# Altium project RK_MEGAPLATA.PrjPcb (part 7 of 9)

## Sheet SD_CARD_SDIO.SchDoc
size 209 x 297 mm; SheetNumber: 19; SheetTotal: 23
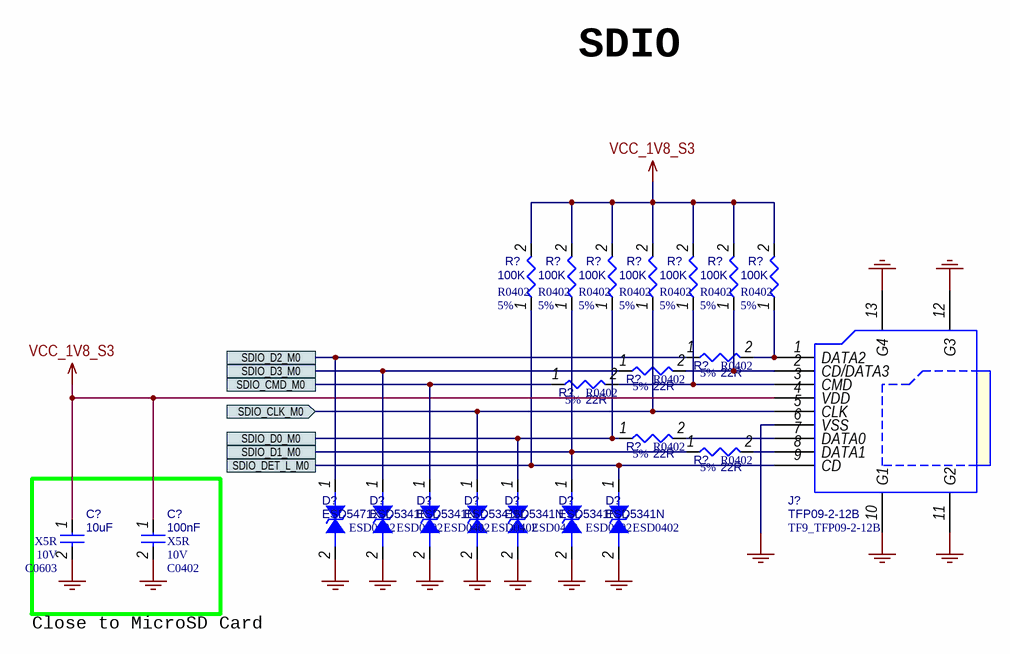
[diagram p21: SD_CARD_SDIO.SchDoc]

### Parts
(Parts that share a designator on the sheet are numbered #1, #2 ... from top to bottom, then left to right.)
C?#301  10uF  Dielectric: X5R  Voltage: 10V  [C0603]
C?#302  100nF  Dielectric: X5R  Voltage: 10V  [C0402]
D?#10  ESD5471X  [ESD0402]
D?#11  ESD5341N  [ESD0402]
D?#12  ESD5341N  [ESD0402]
D?#13  ESD5341N  [ESD0402]
D?#14  ESD5341N  [ESD0402]
D?#15  ESD5341N  [ESD0402]
D?#16  ESD5341N  [ESD0402]
J?#5  TFP09-2-12B  PCB Footprint: TF9_TFP09-2-12B  [TF-CKT01-009D]
R?#126  100K  Tolerance: 5%  [R0402]
R?#127  100K  Tolerance: 5%  [R0402]
R?#128  100K  Tolerance: 5%  [R0402]
R?#129  100K  Tolerance: 5%  [R0402]
R?#130  100K  Tolerance: 5%  [R0402]
R?#131  100K  Tolerance: 5%  [R0402]
R?#132  100K  Tolerance: 5%  [R0402]
R?#133  22R  Tolerance: 5%  [R0402]
R?#134  22R  Tolerance: 5%  [R0402]
R?#135  22R  Tolerance: 5%  [R0402]
R?#136  22R  Tolerance: 5%  [R0402]
R?#137  22R  Tolerance: 5%  [R0402]

### Ports
SDIO_CLK_M0 (in, see RK3588_BOOTLOADER_MAYBE_SDIO[2C]), SDIO_CMD_M0 (see RK3588_BOOTLOADER_MAYBE_SDIO[2C]), SDIO_D0_M0 (see RK3588_BOOTLOADER_MAYBE_SDIO[2C]), SDIO_D1_M0 (see RK3588_BOOTLOADER_MAYBE_SDIO[2C]), SDIO_D2_M0 (see RK3588_BOOTLOADER_MAYBE_SDIO[2C]), SDIO_D3_M0 (see RK3588_BOOTLOADER_MAYBE_SDIO[2C]), SDIO_DET_L_M0 (see RK3588_BOOTLOADER_MAYBE_SDIO[2C])

### Nets
GND: C?#301.2 C?#302.2 D?#10.2 D?#11.2 D?#12.2 D?#13.2 D?#14.2 D?#15.2 D?#16.2 J?#5.6(VSS) J?#5.10(G1) J?#5.11(G2) J?#5.12(G3) J?#5.13(G4)
VCC_1V8_S3: C?#301.1 C?#302.1 J?#5.4(VDD) R?#126.2 R?#127.2 R?#128.2 R?#129.2 R?#130.2 R?#131.2 R?#132.2
NetD?#10_1: D?#10.1 R?#133.1 ; port SDIO_D2_M0
NetD?#11_1: D?#11.1 R?#134.1 ; port SDIO_D3_M0
NetD?#12_1: D?#12.1 R?#135.1 ; port SDIO_CMD_M0
NetD?#13_1: D?#13.1 J?#5.5(CLK) R?#129.1 ; port SDIO_CLK_M0
NetD?#14_1: D?#14.1 R?#128.1 R?#136.1 ; port SDIO_D0_M0
NetD?#15_1: D?#15.1 R?#127.1 R?#137.1 ; port SDIO_D1_M0
NetD?#16_1: D?#16.1 J?#5.9(CD) R?#126.1 ; port SDIO_DET_L_M0
NetJ?#5_1: J?#5.1(DATA2) R?#132.1 R?#133.2
NetJ?#5_2: J?#5.2(CD/DATA3) R?#131.1 R?#134.2
NetJ?#5_3: J?#5.3(CMD) R?#130.1 R?#135.2
NetJ?#5_7: J?#5.7(DATA0) R?#136.2
NetJ?#5_8: J?#5.8(DATA1) R?#137.2

### Notes on the sheet
- SDIO
- Close to MicroSD Card
- 297x210
- Формат А4

### Library data of the parts
C?#301 = CAP NP_Dup1: cap,10.00uF,+/-10%,10V,X5R,C0603; Part Reference: C4201; Manufacturer PN: C1608X5R1A106K080AC; Manufacturer: TDK; Tolerance: 10%; C_Voltage: 6.3V; Priority: A; PCB Footprint: C0603; Value: 10uF; Created by: JJJ; Part Type: C0603; RK PN: C1608X5R1A106K080AC
C?#302 = CAP NP_Dup1: cap,100.00nF,+/-10%,10V,X5R,C0402; Part Reference: C4202; Manufacturer PN: C1005X5R1A104K050BA; Manufacturer: TDK; C_Voltage: 6.3V; Tolerance: 10%; Priority: A; Number: 37; PCB Footprint: C0402; Value: 100nF; Created by: JJJ; Part Type: C0402; RK PN: C1005X5R1A104K050BA
D?#10 = DIODE BI_DIR TRIG: 1-Line, Bi-directional, Transient Voltage Suppressors.9pF.; Part Reference: D4201; Manufacturer: WillSemi(О¤¶ы°лµјМе); Priority: A; PCB Footprint: ESD0402; Value: ESD5471X; Created by: JJJ; Manufacturer PN: ESD5471X; Part Type: ESD_TVS; RK PN: ESD5471X
D?#11 = DIODE BI_DIR TRIG: 1-Line, Bi-directional, Transient Voltage Suppressors.1pF.; Part Reference: D4202; Manufacturer: WillSemi(О¤¶ы°лµјМе); Priority: A; PCB Footprint: ESD0402; Value: ESD5341N; Created by: JJJ; Manufacturer PN: ESD5341N; Part Type: ESD_TVS; RK PN: ESD5341N
D?#12 = DIODE BI_DIR TRIG: 1-Line, Bi-directional, Transient Voltage Suppressors.1pF.; Part Reference: D4203; Manufacturer: WillSemi(О¤¶ы°лµјМе); Priority: A; PCB Footprint: ESD0402; Value: ESD5341N; Created by: JJJ; Manufacturer PN: ESD5341N; Part Type: ESD_TVS; RK PN: ESD5341N
D?#13 = DIODE BI_DIR TRIG: 1-Line, Bi-directional, Transient Voltage Suppressors.1pF.; Part Reference: D4204; Manufacturer: WillSemi(О¤¶ы°лµјМе); Priority: A; PCB Footprint: ESD0402; Value: ESD5341N; RK PN: ESD5341N; Part Type: ESD_TVS; Manufacturer PN: ESD5341N; Created by: JJJ
D?#14 = DIODE BI_DIR TRIG: 1-Line, Bi-directional, Transient Voltage Suppressors.1pF.; Part Reference: D4205; Manufacturer: WillSemi(О¤¶ы°лµјМе); Priority: A; PCB Footprint: ESD0402; Value: ESD5341N; RK PN: ESD5341N; Part Type: ESD_TVS; Manufacturer PN: ESD5341N; Created by: JJJ
D?#15 = DIODE BI_DIR TRIG: 1-Line, Bi-directional, Transient Voltage Suppressors.1pF.; Part Reference: D4206; Manufacturer: WillSemi(О¤¶ы°лµјМе); Priority: A; PCB Footprint: ESD0402; Value: ESD5341N; RK PN: ESD5341N; Part Type: ESD_TVS; Manufacturer PN: ESD5341N; Created by: JJJ
D?#16 = DIODE BI_DIR TRIG: 1-Line, Bi-directional, Transient Voltage Suppressors.1pF.; Part Reference: D4207; Manufacturer: WillSemi(О¤¶ы°лµјМе); Priority: A; PCB Footprint: ESD0402; Value: ESD5341N; RK PN: ESD5341N; Part Type: ESD_TVS; Manufacturer PN: ESD5341N; Created by: JJJ
J?#5 = TFCARD_SOCKET: НЁУГTFїЁЧщЈ¬И«іЯґз; Part Reference: J4200; Manufacturer: НъїЖґп; Priority: A; Value: TFP09-2-12B; Created by: JJJ; Manufacturer Part Number: TFP09-2-12B; Part Type: CARD Jack; RK PN: TFP09-2-12B
R?#126-R?#132 = RESISTOR_Dup2: НЁУГєсД¤µзЧи,100K,+/-5%,R0402,1/16W.; Part Reference: R4203; Manufacturer: YAGEO; RK PN: RC0402JR-07100KL; Priority: A; Wattage: 1/16W; PCB Footprint: R0402; Value: 100K; Part Type: НЁУГєсД¤µзЧи; Manufacturer PN: RC0402JR-07100KL; Created by: YTL
R?#133-R?#137 = RESISTOR_Dup2: НЁУГєсД¤µзЧи,22R,+/-5%,R0402,1/16W.; Part Reference: R1320; Manufacturer PN: RC0402JR-0722RL; Manufacturer: YAGEO; Wattage: 1/16W; Priority: A; PCB Footprint: R0402; Value: 22R; Created by: YTL; Part Type: НЁУГєсД¤µзЧи; RK PN: RC0402JR-0722RL

## Sheet HDMI2_0_RX.SchDoc
size 420 x 297 mm; SheetNumber: 20; SheetTotal: 23
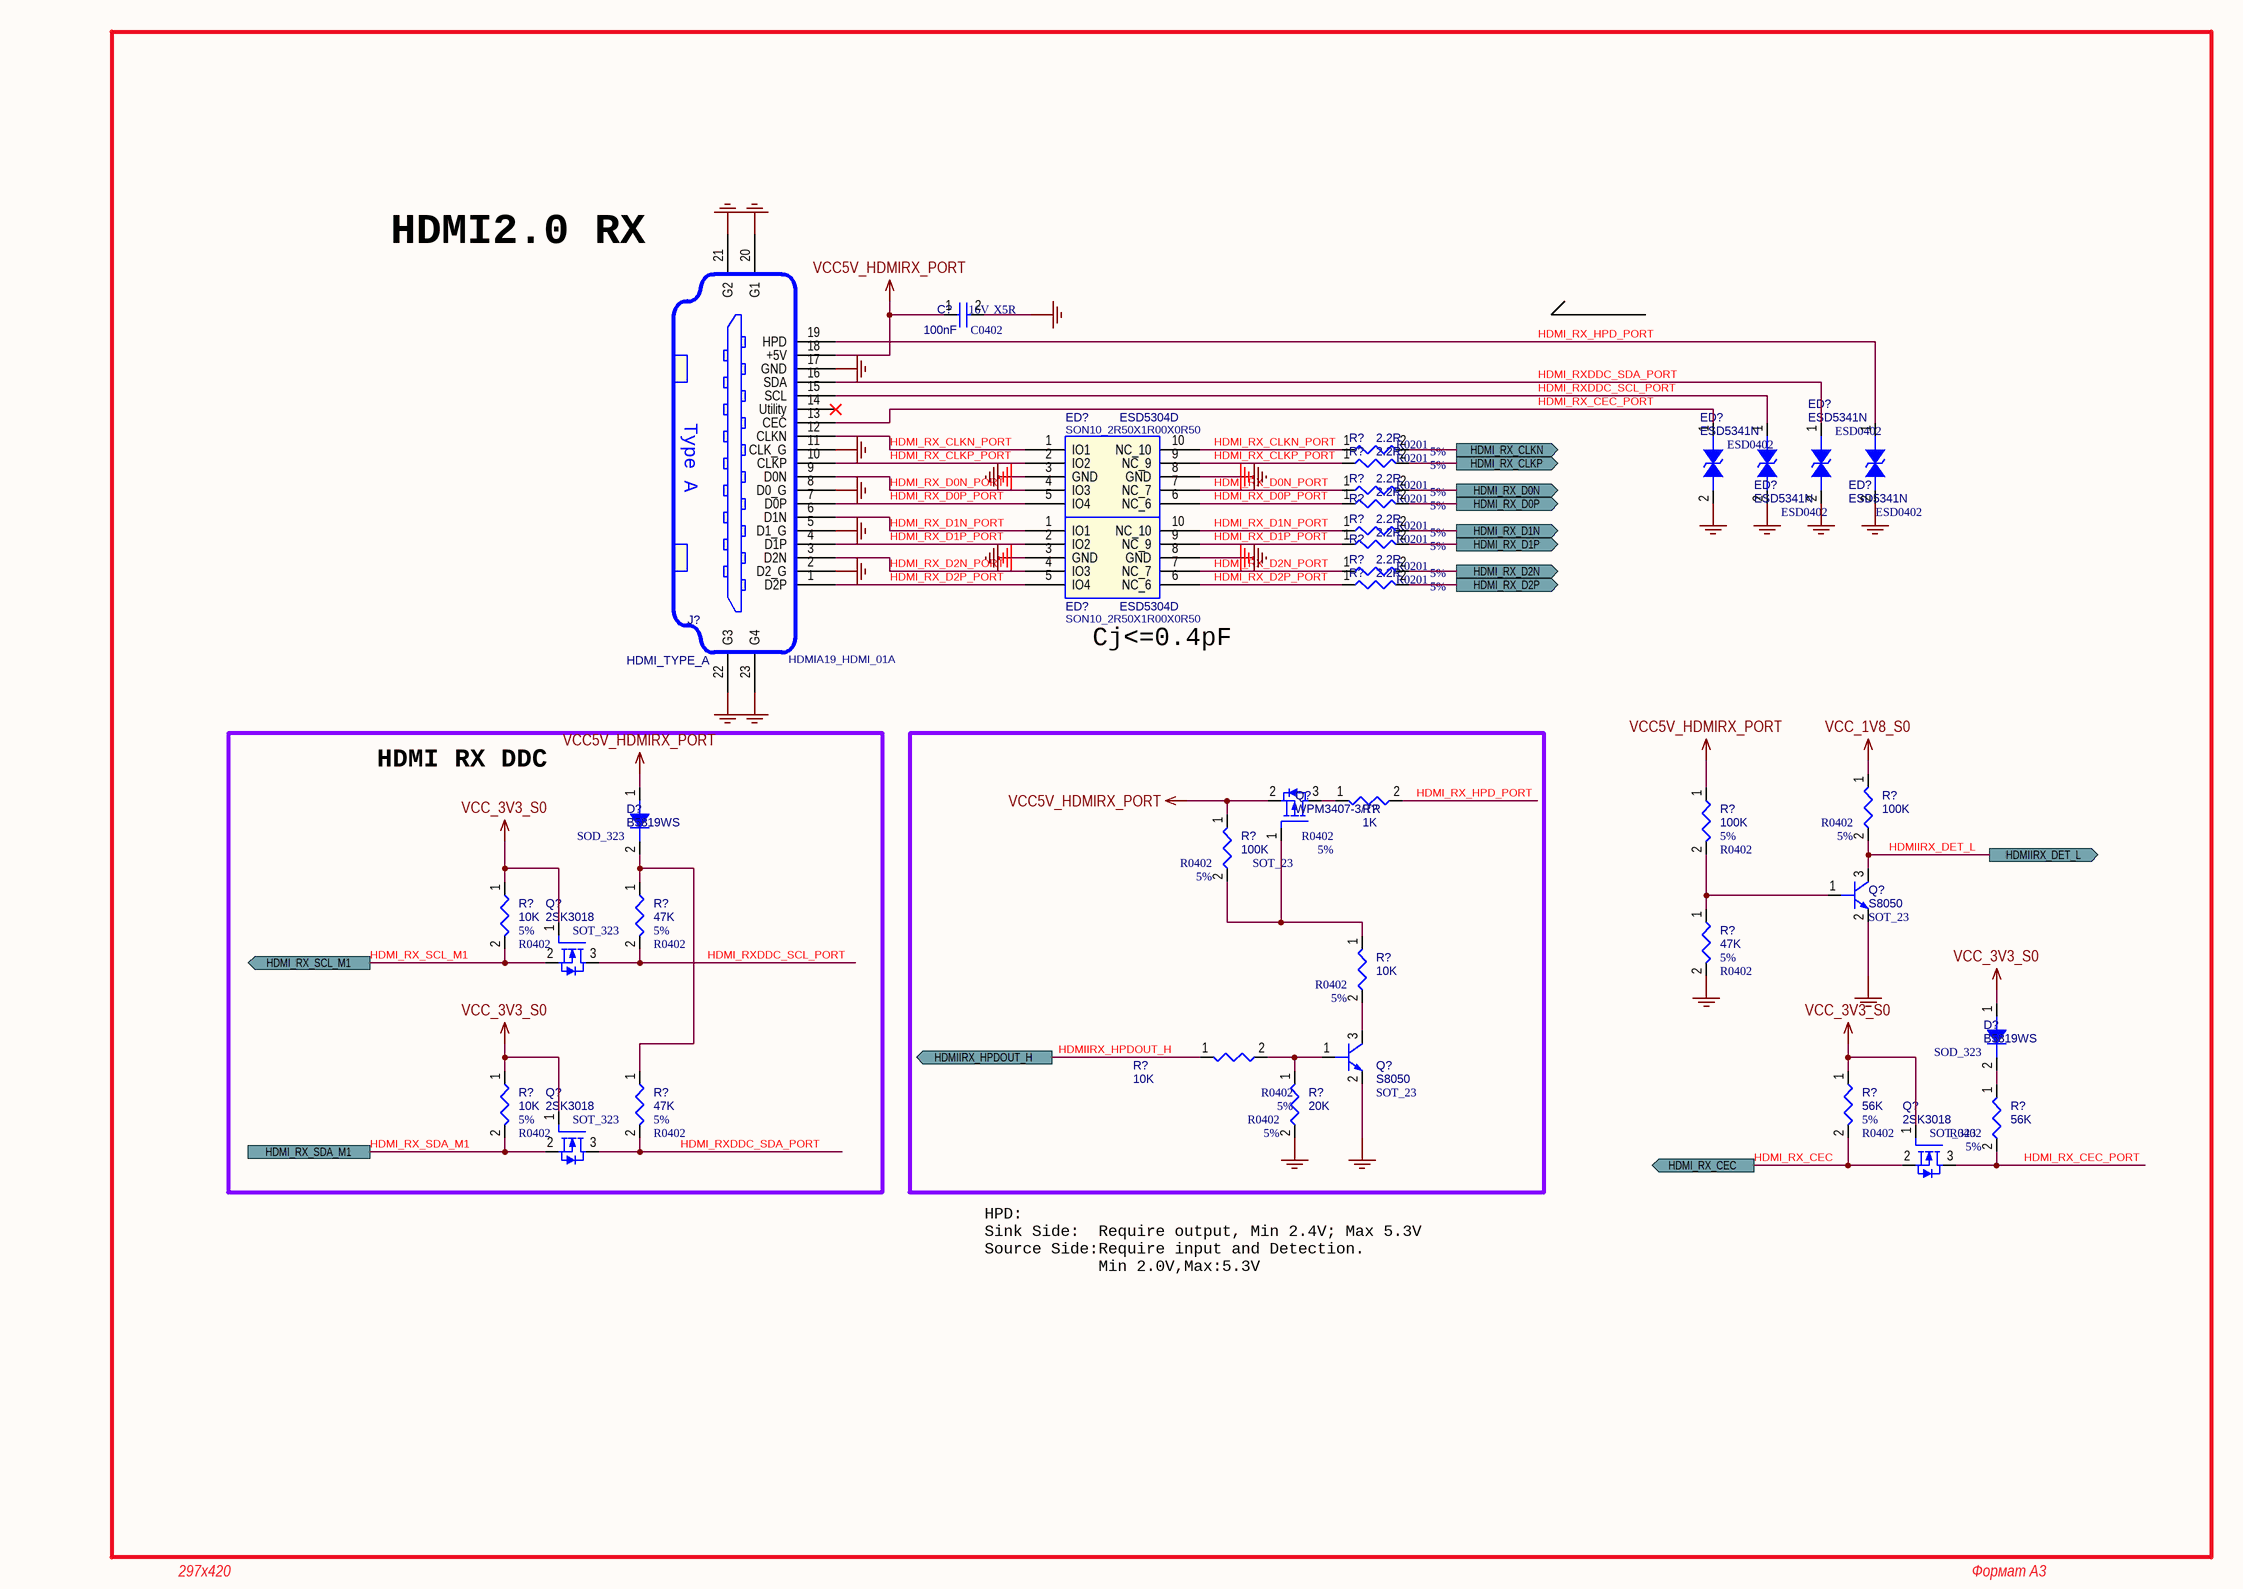
[diagram p22: HDMI2_0_RX.SchDoc]

### Parts
(Parts that share a designator on the sheet are numbered #1, #2 ... from top to bottom, then left to right.)
C?#303  100nF  Dielectric: X5R  Voltage: 16V  [C0402]
D?#17  B5819WS  [SOD_323]
D?#18  B5819WS  [SOD_323]
ED?#7  ESD5304D  [SON10_2R50X1R00X0R50]
ED?#8  ESD5341N  [ESD0402]
ED?#9  ESD5341N  [ESD0402]
ED?#10  ESD5341N  [ESD0402]
ED?#11  ESD5341N  [ESD0402]
ED?#12  ESD5304D  [SON10_2R50X1R00X0R50]
J?#6  HDMI_TYPE_A  [HDMIA19_HDMI_01A]
Q?#2  WPM3407-3/TR  PCB Footprint: SOT_23  [SOT23]
Q?#3  S8050  [SOT_23]
Q?#4  2SK3018  PCB Footprint: SOT_323  [SOT23]
Q?#5  S8050  [SOT_23]
Q?#6  2SK3018  PCB Footprint: SOT_323  [SOT23]
Q?#7  2SK3018  PCB Footprint: SOT_323  [SOT23]
R?#138  2.2R  Tolerance: 5%  PCB Footprint: R0201  [R0402]
R?#139  2.2R  Tolerance: 5%  PCB Footprint: R0201  [R0402]
R?#140  2.2R  Tolerance: 5%  PCB Footprint: R0201  [R0402]
R?#141  2.2R  Tolerance: 5%  PCB Footprint: R0201  [R0402]
R?#142  2.2R  Tolerance: 5%  PCB Footprint: R0201  [R0402]
R?#143  2.2R  Tolerance: 5%  PCB Footprint: R0201  [R0402]
R?#144  2.2R  Tolerance: 5%  PCB Footprint: R0201  [R0402]
R?#145  2.2R  Tolerance: 5%  PCB Footprint: R0201  [R0402]
R?#146  1K  Tolerance: 5%  [R0402]
R?#147  100K  Tolerance: 5%  [R0402]
R?#148  100K  Tolerance: 5%  [R0402]
R?#149  100K  Tolerance: 5%  [R0402]
R?#150  10K  Tolerance: 5%  [R0402]
R?#151  47K  Tolerance: 5%  [R0402]
R?#152  47K  Tolerance: 5%  [R0402]
R?#153  10K  Tolerance: 5%  [R0402]
R?#154  10K  Tolerance: 5%  [R0402]
R?#155  10K  Tolerance: 5%  [R0402]
R?#156  47K  Tolerance: 5%  [R0402]
R?#157  20K  Tolerance: 5%  [R0402]
R?#158  56K  Tolerance: 5%  [R0402]
R?#159  56K  Tolerance: 5%  [R0402]

### Blocks framed on the sheet
HDMI RX DDC: D?#17 Q?#4 Q?#6 R?#150 R?#151 R?#155 R?#156

### Ports
HDMI_RX_CEC (out, see RK3588_GPIO_MAYBE_IMPORTANT_PINS[2B]), HDMI_RX_CLKN (out, see RK3588_HDMI[3B]), HDMI_RX_CLKP (out, see RK3588_HDMI[3B]), HDMI_RX_D0N (out, see RK3588_HDMI[3A]), HDMI_RX_D0P (out, see RK3588_HDMI[3A]), HDMI_RX_D1N (out, see RK3588_HDMI[3A]), HDMI_RX_D1P (out, see RK3588_HDMI[3A]), HDMI_RX_D2N (out, see RK3588_HDMI[3B]), HDMI_RX_D2P (out, see RK3588_HDMI[3A]), HDMI_RX_SCL_M1 (out, see RK3588_GPIO_MAYBE_IMPORTANT_PINS[2B]), HDMI_RX_SDA_M1 (see RK3588_GPIO_MAYBE_IMPORTANT_PINS[2B]), HDMIIRX_DET_L (out, see RK3588_BOOTLOADER_MAYBE_SDIO[2B]), HDMIIRX_HPDOUT_H (out, see RK3588_GPIO_MAYBE_IMPORTANT_PINS[2B])

### Nets
GND: C?#303.2 ED?#7.3(GND) ED?#7.8(GND) ED?#8.2 ED?#9.2 ED?#10.2 ED?#11.2 ED?#12.3(GND) ED?#12.8(GND) J?#6.2(D2_G) J?#6.5(D1_G) J?#6.8(D0_G) J?#6.11(CLK_G) J?#6.17(GND) J?#6.20(G1) J?#6.21(G2) J?#6.22(G3) J?#6.23(G4) Q?#3.2(EMITTER) Q?#5.2(EMITTER) R?#152.2 R?#157.2
VCC5V_HDMIRX_PORT: C?#303.1 D?#17.1(A) J?#6.18(+5V) Q?#2.2(SOURCE) R?#148.1 R?#149.1
VCC_1V8_S0: R?#147.1
VCC_3V3_S0: D?#18.1(A) Q?#4.1(GATE) Q?#6.1(GATE) Q?#7.1(GATE) R?#150.1 R?#155.1 R?#158.1
HDMI_RX_CEC: Q?#7.2(SOURCE) R?#158.2 ; port HDMI_RX_CEC
HDMI_RX_CEC_PORT: ED?#8.1 J?#6.13(CEC) Q?#7.3(DRAIN) R?#159.2
HDMI_RX_CLKN_PORT: ED?#7.1(IO1) ED?#7.10(NC_10) J?#6.12(CLKN) R?#138.1
HDMI_RX_CLKP_PORT: ED?#7.2(IO2) ED?#7.9(NC_9) J?#6.10(CLKP) R?#139.1
HDMI_RX_D0N_PORT: ED?#7.4(IO3) ED?#7.7(NC_7) J?#6.9(D0N) R?#140.1
HDMI_RX_D0P_PORT: ED?#7.5(IO4) ED?#7.6(NC_6) J?#6.7(D0P) R?#141.1
HDMI_RX_D1N_PORT: ED?#12.1(IO1) ED?#12.10(NC_10) J?#6.6(D1N) R?#142.1
HDMI_RX_D1P_PORT: ED?#12.2(IO2) ED?#12.9(NC_9) J?#6.4(D1P) R?#143.1
HDMI_RX_D2N_PORT: ED?#12.4(IO3) ED?#12.7(NC_7) J?#6.3(D2N) R?#144.1
HDMI_RX_D2P_PORT: ED?#12.5(IO4) ED?#12.6(NC_6) J?#6.1(D2P) R?#145.1
HDMI_RX_HPD_PORT: ED?#11.1 J?#6.19(HPD) R?#146.2
HDMI_RX_SCL_M1: Q?#4.2(SOURCE) R?#150.2 ; port HDMI_RX_SCL_M1
HDMI_RX_SDA_M1: Q?#6.2(SOURCE) R?#155.2 ; port HDMI_RX_SDA_M1
HDMI_RXDDC_SCL_PORT: ED?#9.1 J?#6.15(SCL) Q?#4.3(DRAIN) R?#151.2
HDMI_RXDDC_SDA_PORT: ED?#10.1 J?#6.16(SDA) Q?#6.3(DRAIN) R?#156.2
HDMIIRX_DET_L: Q?#3.3(COLLECTOR) R?#147.2 ; port HDMIIRX_DET_L
HDMIIRX_HPDOUT_H: R?#154.1 ; port HDMIIRX_HPDOUT_H
NetD?#17_2: D?#17.2(K) R?#151.1 R?#156.1
NetD?#18_2: D?#18.2(K) R?#159.1
NetQ?#2_1: Q?#2.1(GATE) R?#149.2 R?#153.1
NetQ?#2_3: Q?#2.3(DRAIN) R?#146.1
NetQ?#3_1: Q?#3.1(BASE) R?#148.2 R?#152.1
NetQ?#5_1: Q?#5.1(BASE) R?#154.2 R?#157.1
NetQ?#5_3: Q?#5.3(COLLECTOR) R?#153.2
NetR?#138_2: R?#138.2 ; port HDMI_RX_CLKN
NetR?#139_2: R?#139.2 ; port HDMI_RX_CLKP
NetR?#140_2: R?#140.2 ; port HDMI_RX_D0N
NetR?#141_2: R?#141.2 ; port HDMI_RX_D0P
NetR?#142_2: R?#142.2 ; port HDMI_RX_D1N
NetR?#143_2: R?#143.2 ; port HDMI_RX_D1P
NetR?#144_2: R?#144.2 ; port HDMI_RX_D2N
NetR?#145_2: R?#145.2 ; port HDMI_RX_D2P

Not connected (* = marked no-connect by the designer): J?#6 14(Utility)*

### Notes on the sheet
- HDMI2.0 RX
- (near ED?#12) Cj<=0.4pF
- HPD:
  Sink Side:  Require output, Min 2.4V; Max 5.3V
  Source Side:Require input and Detection.
  Min 2.0V,Max:5.3V
- 297x420
- Формат А3
- (in symbol HDMI_TYPE_A_0) Type A

### Library data of the parts
C?#303 = CAP NP_Dup1: cap,100.00nF,+/-10%,16V,X5R,C0402; Part Reference: C4900; Manufacturer PN: C1005X5R1C104K050BA; Manufacturer: TDK; C_Voltage: 10V; Tolerance: 10%; Priority: A; Number: 37; PCB Footprint: C0402; Value: 100nF; Created by: JJJ; Part Type: C0402; RK PN: C1005X5R1C104K050BA
D?#17 = DIODE: Schottky BarrierЈ¬B5819WS SOD-323; Part Reference: D4900; Manufacturer: і¤µз; Priority: A; PCB Footprint: SOD_323; Value: B5819WS; Created by: JJJ; Manufacturer PN: B5819WS; Part Type: Schottky rectifier; RK PN: B5819WS
D?#18 = DIODE: Schottky BarrierЈ¬B5819WS SOD-323; Part Reference: D4901; Manufacturer: і¤µз; Priority: A; PCB Footprint: SOD_323; Value: B5819WS; RK PN: B5819WS; Part Type: Schottky rectifier; Manufacturer PN: B5819WS; Created by: JJJ
ED?#7 = ESD_ESD5304D: 4-Lines, Uni-directional, Ultra-low Capacitance Transient Voltage Suppressors; Part Reference: ED4900; Manufacturer: WillSemi(О¤¶ы°лµјМе); Priority: A; PCB Footprint: SON10_2R50X1R00X0R50; Value: ESD5304D; Created by: JJJ; Manufacturer PN: ESD5304D; Part Type: ESD_TVS; RK PN: ESD5304D
ED?#8 = DIODE BI_DIR TRIG: 1-Line, Bi-directional, Transient Voltage Suppressors.1pF.; Part Reference: ED4901; Manufacturer: WillSemi(О¤¶ы°лµјМе); Priority: A; PCB Footprint: ESD0402; Value: ESD5341N; Created by: JJJ; Manufacturer PN: ESD5341N; Part Type: ESD_TVS; RK PN: ESD5341N
ED?#9 = DIODE BI_DIR TRIG: 1-Line, Bi-directional, Transient Voltage Suppressors.1pF.; Part Reference: ED4902; Manufacturer: WillSemi(О¤¶ы°лµјМе); Priority: A; PCB Footprint: ESD0402; Value: ESD5341N; Created by: JJJ; Manufacturer PN: ESD5341N; Part Type: ESD_TVS; RK PN: ESD5341N
ED?#10 = DIODE BI_DIR TRIG: 1-Line, Bi-directional, Transient Voltage Suppressors.1pF.; Part Reference: ED4903; Manufacturer: WillSemi(О¤¶ы°лµјМе); Priority: A; PCB Footprint: ESD0402; Value: ESD5341N; RK PN: ESD5341N; Part Type: ESD_TVS; Manufacturer PN: ESD5341N; Created by: JJJ
ED?#11 = DIODE BI_DIR TRIG: 1-Line, Bi-directional, Transient Voltage Suppressors.1pF.; Part Reference: ED4904; Manufacturer: WillSemi(О¤¶ы°лµјМе); Priority: A; PCB Footprint: ESD0402; Value: ESD5341N; Created by: JJJ; Manufacturer PN: ESD5341N; Part Type: ESD_TVS; RK PN: ESD5341N
ED?#12 = ESD_ESD5304D: 4-Lines, Uni-directional, Ultra-low Capacitance Transient Voltage Suppressors; Part Reference: ED4905; Manufacturer: WillSemi(О¤¶ы°лµјМе); Priority: A; PCB Footprint: SON10_2R50X1R00X0R50; Value: ESD5304D; Created by: JJJ; Manufacturer PN: ESD5304D; Part Type: ESD_TVS; RK PN: ESD5304D
J?#6 = HDMI_TYPE_A_0: Part Reference: J4900; Value: HDMI_TYPE_A; PCB Footprint: HDMIA19_HDMI_01A
Q?#2 = MOSFET P_Dup1: PMOS,WPM3407-3/TR,SOT_23,Id=4.4A,Vds=30V; Part Reference: Q4901; Manufacturer: WillSemi(О¤¶ы°лµјМе); Pd: 0.9W; Vgsth: 2.0V; VDS: 30V; Vgs: ЎА20V; Id_max: 4.4A; Priority: A; Value: WPM3407-3/TR; Created by: JJJ; Manufacturer PN: WPM3407-3/TR; Part Type: PMOS; RK PN: WPM3407-3/TR
Q?#3 = NPN: S8050,SOT23; Part Reference: Q4900; Manufacturer PN: S8050_SOT23; Manufacturer: і¤µз; Pc: 0.3W; Vceo: 25V; Ic: 0.5A; Priority: A; PCB Footprint: SOT_23; Value: S8050; Created by: JJJ; Part Type: NPN; RK PN: S8050
Q?#4 = MOSFET N_Dup1: NMOS,2SK3018,SOT_323,Id=0.1A,Vds=30V; Part Reference: Q4902; Manufacturer: ROHM; Rds: 5ohm; Priority: A; Id_max: 0.1A; Vgs: 20V; VDS: 30V; Vgsth: 1.5V; Pd: 0.2W; Value: 2SK3018; RK PN: 2SK3018; Part Type: NMOS; Manufacturer PN: 2SK3018; Created by: JJJ
Q?#5 = NPN: S8050,SOT23; Part Reference: Q4903; Manufacturer PN: S8050_SOT23; Manufacturer: і¤µз; Pc: 0.3W; Vceo: 25V; Ic: 0.5A; Priority: A; PCB Footprint: SOT_23; Value: S8050; Created by: JJJ; Part Type: NPN; RK PN: S8050
Q?#6 = MOSFET N_Dup1: NMOS,2SK3018,SOT_323,Id=0.1A,Vds=30V; Part Reference: Q4905; Manufacturer: ROHM; Pd: 0.2W; Vgsth: 1.5V; VDS: 30V; Vgs: 20V; Id_max: 0.1A; Priority: A; Rds: 5ohm; Value: 2SK3018; Created by: JJJ; Manufacturer PN: 2SK3018; Part Type: NMOS; RK PN: 2SK3018
Q?#7 = MOSFET N_Dup1: NMOS,2SK3018,SOT_323,Id=0.1A,Vds=30V; Part Reference: Q4904; Manufacturer: ROHM; Rds: 5ohm; Priority: A; Id_max: 0.1A; Vgs: 20V; VDS: 30V; Vgsth: 1.5V; Pd: 0.2W; Value: 2SK3018; RK PN: 2SK3018; Part Type: NMOS; Manufacturer PN: 2SK3018; Created by: JJJ
R?#138 = RESISTOR_Dup2: НЁУГєсД¤µзЧи,2R2,+/-5%,R0201,1/20W.; Part Reference: R4900; Manufacturer: YAGEO; RK PN: RC0201JR-072R2L; Priority: A; Wattage: 1/20W; Value: 2.2R; Part Type: НЁУГєсД¤µзЧи; Manufacturer PN: RC0201JR-072R2L; Created by: YTL
R?#139 = RESISTOR_Dup2: НЁУГєсД¤µзЧи,2R2,+/-5%,R0201,1/20W.; Part Reference: R4901; Manufacturer PN: RC0201JR-072R2L; Manufacturer: YAGEO; Wattage: 1/20W; Priority: A; Value: 2.2R; Created by: YTL; Part Type: НЁУГєсД¤µзЧи; RK PN: RC0201JR-072R2L
R?#140 = RESISTOR_Dup2: НЁУГєсД¤µзЧи,2R2,+/-5%,R0201,1/20W.; Part Reference: R4902; Manufacturer PN: RC0201JR-072R2L; Manufacturer: YAGEO; Wattage: 1/20W; Priority: A; Value: 2.2R; Created by: YTL; Part Type: НЁУГєсД¤µзЧи; RK PN: RC0201JR-072R2L
R?#141 = RESISTOR_Dup2: НЁУГєсД¤µзЧи,2R2,+/-5%,R0201,1/20W.; Part Reference: R4903; Manufacturer: YAGEO; RK PN: RC0201JR-072R2L; Priority: A; Wattage: 1/20W; Value: 2.2R; Part Type: НЁУГєсД¤µзЧи; Manufacturer PN: RC0201JR-072R2L; Created by: YTL
R?#142 = RESISTOR_Dup2: НЁУГєсД¤µзЧи,2R2,+/-5%,R0201,1/20W.; Part Reference: R4904; Manufacturer PN: RC0201JR-072R2L; Manufacturer: YAGEO; Wattage: 1/20W; Priority: A; Value: 2.2R; Created by: YTL; Part Type: НЁУГєсД¤µзЧи; RK PN: RC0201JR-072R2L
R?#143 = RESISTOR_Dup2: НЁУГєсД¤µзЧи,2R2,+/-5%,R0201,1/20W.; Part Reference: R4905; Manufacturer: YAGEO; RK PN: RC0201JR-072R2L; Priority: A; Wattage: 1/20W; Value: 2.2R; Part Type: НЁУГєсД¤µзЧи; Manufacturer PN: RC0201JR-072R2L; Created by: YTL
R?#144 = RESISTOR_Dup2: НЁУГєсД¤µзЧи,2R2,+/-5%,R0201,1/20W.; Part Reference: R4906; Manufacturer PN: RC0201JR-072R2L; Manufacturer: YAGEO; Wattage: 1/20W; Priority: A; Value: 2.2R; Created by: YTL; Part Type: НЁУГєсД¤µзЧи; RK PN: RC0201JR-072R2L
R?#145 = RESISTOR_Dup2: НЁУГєсД¤µзЧи,2R2,+/-5%,R0201,1/20W.; Part Reference: R4907; Manufacturer: YAGEO; RK PN: RC0201JR-072R2L; Priority: A; Wattage: 1/20W; Value: 2.2R; Part Type: НЁУГєсД¤µзЧи; Manufacturer PN: RC0201JR-072R2L; Created by: YTL
R?#146 = RESISTOR_Dup2: НЁУГєсД¤µзЧи,1K,+/-5%,R0402,1/16W.; Part Reference: R4910; Manufacturer PN: RC0402JR-071KL; Manufacturer: YAGEO; Wattage: 1/16W; Priority: A; PCB Footprint: R0402; Value: 1K; Created by: YTL; Part Type: НЁУГєсД¤µзЧи; RK PN: RC0402JR-071KL
R?#147 = RESISTOR_Dup2: НЁУГєсД¤µзЧи,100K,+/-5%,R0402,1/16W.; Part Reference: R4909; Manufacturer PN: RC0402JR-07100KL; Manufacturer: YAGEO; Wattage: 1/16W; Priority: A; PCB Footprint: R0402; Value: 100K; Created by: YTL; Part Type: НЁУГєсД¤µзЧи; RK PN: RC0402JR-07100KL
R?#148 = RESISTOR_Dup2: НЁУГєсД¤µзЧи,100K,+/-5%,R0402,1/16W.; Part Reference: R4908; Manufacturer: YAGEO; RK PN: RC0402JR-07100KL; Priority: A; Wattage: 1/16W; PCB Footprint: R0402; Value: 100K; Part Type: НЁУГєсД¤µзЧи; Manufacturer PN: RC0402JR-07100KL; Created by: YTL
R?#149 = RESISTOR_Dup2: НЁУГєсД¤µзЧи,100K,+/-5%,R0402,1/16W.; Part Reference: R4912; Manufacturer PN: RC0402JR-07100KL; Manufacturer: YAGEO; Wattage: 1/16W; Priority: A; PCB Footprint: R0402; Value: 100K; Created by: YTL; Part Type: НЁУГєсД¤µзЧи; RK PN: RC0402JR-07100KL
R?#150 = RESISTOR_Dup2: НЁУГєсД¤µзЧи,10K,+/-5%,R0402,1/16W.; Part Reference: R4913; Manufacturer: YAGEO; RK PN: RC0402JR-0710KL; Priority: A; Wattage: 1/16W; PCB Footprint: R0402; Value: 10K; Part Type: НЁУГєсД¤µзЧи; Manufacturer PN: RC0402JR-0710KL; Created by: YTL
R?#151 = RESISTOR_Dup2: НЁУГєсД¤µзЧи,47K,+/-5%,R0402,1/16W.; Part Reference: R4914; Manufacturer PN: RC0402JR-0747KL; Manufacturer: YAGEO; Wattage: 1/16W; Priority: A; PCB Footprint: R0402; Value: 47K; Created by: YTL; Part Type: НЁУГєсД¤µзЧи; RK PN: RC0402JR-0747KL
R?#152 = RESISTOR_Dup2: НЁУГєсД¤µзЧи,47K,+/-5%,R0402,1/16W.; Part Reference: R4911; Manufacturer PN: RC0402JR-0747KL; Manufacturer: YAGEO; Wattage: 1/16W; Priority: A; PCB Footprint: R0402; Value: 47K; Created by: YTL; Part Type: НЁУГєсД¤µзЧи; RK PN: RC0402JR-0747KL
R?#153 = RESISTOR_Dup2: НЁУГєсД¤µзЧи,10K,+/-5%,R0402,1/16W.; Part Reference: R4915; Manufacturer: YAGEO; RK PN: RC0402JR-0710KL; Priority: A; Wattage: 1/16W; PCB Footprint: R0402; Value: 10K; Part Type: НЁУГєсД¤µзЧи; Manufacturer PN: RC0402JR-0710KL; Created by: YTL
R?#154 = RESISTOR_Dup2: НЁУГєсД¤µзЧи,10K,+/-5%,R0402,1/16W.; Part Reference: R4918; Manufacturer PN: RC0402JR-0710KL; Manufacturer: YAGEO; Wattage: 1/16W; Priority: A; PCB Footprint: R0402; Value: 10K; Created by: YTL; Part Type: НЁУГєсД¤µзЧи; RK PN: RC0402JR-0710KL
R?#155 = RESISTOR_Dup2: НЁУГєсД¤µзЧи,10K,+/-5%,R0402,1/16W.; Part Reference: R4919; Manufacturer PN: RC0402JR-0710KL; Manufacturer: YAGEO; Wattage: 1/16W; Priority: A; PCB Footprint: R0402; Value: 10K; Created by: YTL; Part Type: НЁУГєсД¤µзЧи; RK PN: RC0402JR-0710KL
R?#156 = RESISTOR_Dup2: НЁУГєсД¤µзЧи,47K,+/-5%,R0402,1/16W.; Part Reference: R4920; Manufacturer PN: RC0402JR-0747KL; Manufacturer: YAGEO; Wattage: 1/16W; Priority: A; PCB Footprint: R0402; Value: 47K; Created by: YTL; Part Type: НЁУГєсД¤µзЧи; RK PN: RC0402JR-0747KL
R?#157 = RESISTOR_Dup2: НЁУГєсД¤µзЧи,20K,+/-5%,R0402,1/16W.; Part Reference: R4921; Manufacturer: YAGEO; RK PN: RC0402JR-0720KL; Priority: A; Wattage: 1/16W; PCB Footprint: R0402; Value: 20K; Part Type: НЁУГєсД¤µзЧи; Manufacturer PN: RC0402JR-0720KL; Created by: YTL
R?#158 = RESISTOR_Dup2: НЁУГєсД¤µзЧи,56K,+/-5%,R0402,1/16W.; Part Reference: R4916; Manufacturer PN: RC0402JR-0756KL; Manufacturer: YAGEO; Wattage: 1/16W; Priority: A; PCB Footprint: R0402; Value: 56K; Created by: YTL; Part Type: НЁУГєсД¤µзЧи; RK PN: RC0402JR-0756KL
R?#159 = RESISTOR_Dup2: НЁУГєсД¤µзЧи,56K,+/-5%,R0402,1/16W.; Part Reference: R4917; Manufacturer: YAGEO; RK PN: RC0402JR-0756KL; Priority: A; Wattage: 1/16W; PCB Footprint: R0402; Value: 56K; Part Type: НЁУГєсД¤µзЧи; Manufacturer PN: RC0402JR-0756KL; Created by: YTL

## Sheet MIPI_D_CPHY_TX_DUAL.SchDoc
size 420 x 297 mm; SheetNumber: 21; SheetTotal: 23
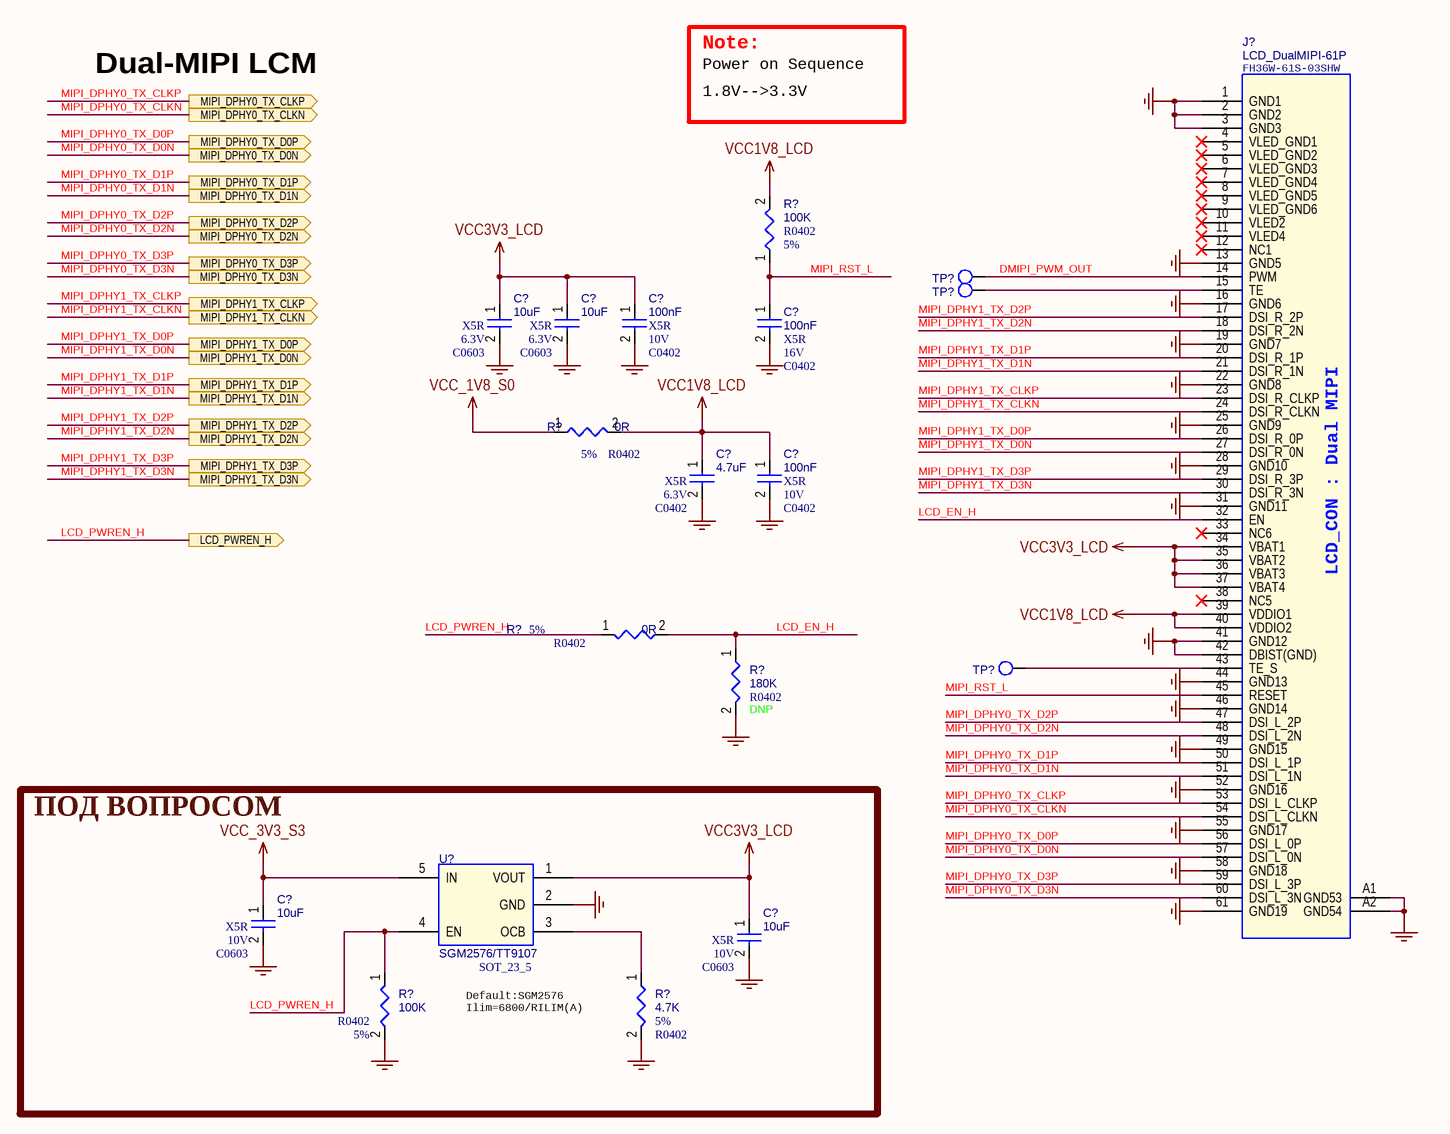
[diagram p23: MIPI_D_CPHY_TX_DUAL.SchDoc]

### Parts
(Parts that share a designator on the sheet are numbered #1, #2 ... from top to bottom, then left to right.)
C?#304  10uF  Dielectric: X5R  Voltage: 6.3V  [C0603]
C?#305  10uF  Dielectric: X5R  Voltage: 6.3V  [C0603]
C?#306  100nF  Dielectric: X5R  Voltage: 10V  [C0402]
C?#307  100nF  Dielectric: X5R  Voltage: 16V  [C0402]
C?#308  4.7uF  Dielectric: X5R  Voltage: 6.3V  [C0402]
C?#309  100nF  Dielectric: X5R  Voltage: 10V  [C0402]
C?#310  10uF  Dielectric: X5R  Voltage: 10V  [C0603]
C?#311  10uF  Dielectric: X5R  Voltage: 10V  [C0603]
J?#7  LCD_DualMIPI-61P  [FH36W-61S-03SHW]
R?#160  100K  Tolerance: 5%  [R0402]
R?#161  0R  Tolerance: 5%  [R0402]
R?#162  0R  Tolerance: 5%  [R0402]
R?#163  180K  Option: DNP  [R0402]
R?#164  100K  Tolerance: 5%  [R0402]
R?#165  4.7K  Tolerance: 5%  [R0402]
TP?#5  TP_0.7  [TEST]  (value not drawn)
TP?#6  TP_0.7  [TEST]  (value not drawn)
TP?#7  TP_0.7  [TEST]  (value not drawn)
U?#40  SGM2576/TT9107  [SOT_23_5]

### Blocks framed on the sheet
ПОД ВОПРОСОМ: C?#310 C?#311 R?#164 R?#165 U?#40

### Ports
LCD_PWREN_H (out, see RK3588_GPIO_MAYBE_IMPORTANT_PINS[4C]), MIPI_DPHY0_TX_CLKN (out, see RK3588_MIPI[2A]), MIPI_DPHY0_TX_CLKP (out, see RK3588_MIPI[2A]), MIPI_DPHY0_TX_D0N (out, see RK3588_MIPI[2A]), MIPI_DPHY0_TX_D0P (out, see RK3588_MIPI[2A]), MIPI_DPHY0_TX_D1N (out, see RK3588_MIPI[2A]), MIPI_DPHY0_TX_D1P (out, see RK3588_MIPI[2A]), MIPI_DPHY0_TX_D2N (out, see RK3588_MIPI[2A]), MIPI_DPHY0_TX_D2P (out, see RK3588_MIPI[2A]), MIPI_DPHY0_TX_D3N (out, see RK3588_MIPI[2A]), MIPI_DPHY0_TX_D3P (out, see RK3588_MIPI[2A]), MIPI_DPHY1_TX_CLKN (out, see RK3588_MIPI[4A]), MIPI_DPHY1_TX_CLKP (out, see RK3588_MIPI[4A]), MIPI_DPHY1_TX_D0N (out, see RK3588_MIPI[4A]), MIPI_DPHY1_TX_D0P (out, see RK3588_MIPI[4A]), MIPI_DPHY1_TX_D1N (out, see RK3588_MIPI[4A]), MIPI_DPHY1_TX_D1P (out, see RK3588_MIPI[4A]), MIPI_DPHY1_TX_D2N (out, see RK3588_MIPI[4A]), MIPI_DPHY1_TX_D2P (out, see RK3588_MIPI[4A]), MIPI_DPHY1_TX_D3N (out, see RK3588_MIPI[4A]), MIPI_DPHY1_TX_D3P (out, see RK3588_MIPI[4A])

### Nets
GND: C?#304.2 C?#305.2 C?#306.2 C?#307.2 C?#308.2 C?#309.2 C?#310.2 C?#311.2 J?#7.1(GND1) J?#7.2(GND2) J?#7.3(GND3) J?#7.13(GND5) J?#7.16(GND6) J?#7.19(GND7) J?#7.22(GND8) J?#7.25(GND9) J?#7.28(GND10) J?#7.31(GND11) J?#7.41(GND12) J?#7.42(DBIST(GND)) J?#7.44(GND13) J?#7.46(GND14) J?#7.49(GND15) J?#7.52(GND16) J?#7.55(GND17) J?#7.58(GND18) J?#7.61(GND19) J?#7.A1(GND53) J?#7.A2(GND54) R?#163.2 R?#164.2 R?#165.2 U?#40.2(GND)
VCC1V8_LCD: C?#308.1 C?#309.1 J?#7.39(VDDIO1) J?#7.40(VDDIO2) R?#160.2 R?#161.2
VCC3V3_LCD: C?#304.1 C?#305.1 C?#306.1 C?#311.1 J?#7.34(VBAT1) J?#7.35(VBAT2) J?#7.36(VBAT3) J?#7.37(VBAT4) U?#40.1(VOUT)
VCC_1V8_S0: R?#161.1
VCC_3V3_S3: C?#310.1 U?#40.5(IN)
DMIPI_PWM_OUT: J?#7.14(PWM) TP?#5.1
LCD_EN_H: J?#7.32(EN) R?#162.2 R?#163.1
LCD_PWREN_H: R?#162.1 R?#164.1 U?#40.4(EN) ; port LCD_PWREN_H
MIPI_DPHY0_TX_CLKN: J?#7.54(DSI_L_CLKN) ; port MIPI_DPHY0_TX_CLKN
MIPI_DPHY0_TX_CLKP: J?#7.53(DSI_L_CLKP) ; port MIPI_DPHY0_TX_CLKP
MIPI_DPHY0_TX_D0N: J?#7.57(DSI_L_0N) ; port MIPI_DPHY0_TX_D0N
MIPI_DPHY0_TX_D0P: J?#7.56(DSI_L_0P) ; port MIPI_DPHY0_TX_D0P
MIPI_DPHY0_TX_D1N: J?#7.51(DSI_L_1N) ; port MIPI_DPHY0_TX_D1N
MIPI_DPHY0_TX_D1P: J?#7.50(DSI_L_1P) ; port MIPI_DPHY0_TX_D1P
MIPI_DPHY0_TX_D2N: J?#7.48(DSI_L_2N) ; port MIPI_DPHY0_TX_D2N
MIPI_DPHY0_TX_D2P: J?#7.47(DSI_L_2P) ; port MIPI_DPHY0_TX_D2P
MIPI_DPHY0_TX_D3N: J?#7.60(DSI_L_3N) ; port MIPI_DPHY0_TX_D3N
MIPI_DPHY0_TX_D3P: J?#7.59(DSI_L_3P) ; port MIPI_DPHY0_TX_D3P
MIPI_DPHY1_TX_CLKN: J?#7.24(DSI_R_CLKN) ; port MIPI_DPHY1_TX_CLKN
MIPI_DPHY1_TX_CLKP: J?#7.23(DSI_R_CLKP) ; port MIPI_DPHY1_TX_CLKP
MIPI_DPHY1_TX_D0N: J?#7.27(DSI_R_0N) ; port MIPI_DPHY1_TX_D0N
MIPI_DPHY1_TX_D0P: J?#7.26(DSI_R_0P) ; port MIPI_DPHY1_TX_D0P
MIPI_DPHY1_TX_D1N: J?#7.21(DSI_R_1N) ; port MIPI_DPHY1_TX_D1N
MIPI_DPHY1_TX_D1P: J?#7.20(DSI_R_1P) ; port MIPI_DPHY1_TX_D1P
MIPI_DPHY1_TX_D2N: J?#7.18(DSI_R_2N) ; port MIPI_DPHY1_TX_D2N
MIPI_DPHY1_TX_D2P: J?#7.17(DSI_R_2P) ; port MIPI_DPHY1_TX_D2P
MIPI_DPHY1_TX_D3N: J?#7.30(DSI_R_3N) ; port MIPI_DPHY1_TX_D3N
MIPI_DPHY1_TX_D3P: J?#7.29(DSI_R_3P) ; port MIPI_DPHY1_TX_D3P
MIPI_RST_L: C?#307.1 J?#7.45(RESET) R?#160.1
NetJ?#7_15: J?#7.15(TE) TP?#6.1
NetJ?#7_43: J?#7.43(TE_S) TP?#7.1
NetR?#165_1: R?#165.1 U?#40.3(OCB)

Not connected (* = marked no-connect by the designer): J?#7 4(VLED_GND1)* 5(VLED_GND2)* 6(VLED_GND3)* 7(VLED_GND4)* 8(VLED_GND5)* 9(VLED_GND6)* 10(VLED2)* 11(VLED4)* 12(NC1)* 33(NC6)* 38(NC5)*

### Notes on the sheet
- Note:
- Dual-MIPI LCM
- Power on Sequence
- 1.8V-->3.3V
- Default:SGM2576
  Ilim=6800/RILIM(A)
- 297x420
- Формат А3
- (in symbol LCD_Dual MIPI-61P_1) LCD_CON : Dual MIPI

### Library data of the parts
C?#304 = CAP NP_Dup1: cap,10.00uF,+/-10%,6.3V,X5R,C0603; Part Reference: C5350; Manufacturer: TDK; RK PN: C1608X5R0J106K080AB; Priority: A; Tolerance: 10%; PCB Footprint: C0603; Value: 10uF; Part Type: C0603; C_Voltage: 6.3V; Manufacturer PN: C1608X5R0J106K080AB; Created by: JJJ
C?#305 = CAP NP_Dup1: cap,10.00uF,+/-10%,6.3V,X5R,C0603; Part Reference: C5351; Manufacturer: TDK; RK PN: C1608X5R0J106K080AB; Priority: A; Tolerance: 10%; PCB Footprint: C0603; Value: 10uF; Part Type: C0603; C_Voltage: 6.3V; Manufacturer PN: C1608X5R0J106K080AB; Created by: JJJ
C?#306 = CAP NP_Dup1: cap,100.00nF,+/-10%,10V,X5R,C0402; Part Reference: C5352; Manufacturer PN: C1005X5R1A104K050BA; Manufacturer: TDK; Tolerance: 10%; Priority: A; PCB Footprint: C0402; Value: 100nF; Created by: JJJ; Part Type: C0402; RK PN: C1005X5R1A104K050BA
C?#307 = CAP NP_Dup1: cap,100.00nF,+/-10%,16V,X5R,C0402; Part Reference: C5340; Manufacturer: TDK; Number: 37; RK PN: C1005X5R1C104K050BA; Priority: A; Tolerance: 10%; C_Voltage: 6.3V; PCB Footprint: C0402; Value: 100nF; Part Type: C0402; Manufacturer PN: C1005X5R1C104K050BA; Created by: JJJ
C?#308 = CAP NP_Dup1: cap,4.70uF,+/-10%,6.3V,X5R,C0402; Part Reference: C5302; Manufacturer PN: C1005X5R0J475K050BC; Manufacturer: TDK; Tolerance: 10%; Priority: A; PCB Footprint: C0402; Value: 4.7uF; Created by: JJJ; C_Voltage: 6.3V; Part Type: C0402; RK PN: C1005X5R0J475K050BC
C?#309 = CAP NP_Dup1: cap,100.00nF,+/-10%,10V,X5R,C0402; Part Reference: C5303; Manufacturer: TDK; RK PN: C1005X5R1A104K050BA; Priority: A; Tolerance: 10%; PCB Footprint: C0402; Value: 100nF; Part Type: C0402; Manufacturer PN: C1005X5R1A104K050BA; Created by: JJJ
C?#310 = CAP NP_Dup1: cap,10.00uF,+/-10%,10V,X5R,C0603; Part Reference: C2333; Manufacturer PN: C1608X5R1A106K080AC; Manufacturer: TDK; Tolerance: 10%; C_Voltage: 6.3V; Priority: A; PCB Footprint: C0603; Value: 10uF; Created by: JJJ; Part Type: C0603; RK PN: C1608X5R1A106K080AC
C?#311 = CAP NP_Dup1: cap,10.00uF,+/-10%,10V,X5R,C0603; Part Reference: C2335; Manufacturer PN: C1608X5R1A106K080AC; Manufacturer: TDK; Tolerance: 10%; C_Voltage: 6.3V; Priority: A; PCB Footprint: C0603; Value: 10uF; Created by: JJJ; Part Type: C0603; RK PN: C1608X5R1A106K080AC
J?#7 = LCD_Dual MIPI-61P_1: Part Reference: J5300; Value: LCD_DualMIPI-61P; PCB Footprint: FH36W-61S-03SHW
R?#160 = RESISTOR_Dup2: НЁУГєсД¤µзЧи,100K,+/-5%,R0402,1/16W.; Part Reference: R5305; Manufacturer PN: RC0402JR-07100KL; Manufacturer: YAGEO; Wattage: 1/16W; Priority: A; PCB Footprint: R0402; Value: 100K; Created by: YTL; Part Type: НЁУГєсД¤µзЧи; RK PN: RC0402JR-07100KL
R?#161 = RESISTOR_Dup2: НЁУГєсД¤µзЧи,0R,+/-5%,R0402,1/16W.; Part Reference: R5301; Manufacturer: YAGEO; RK PN: RC0402JR-070RL; Priority: A; Wattage: 1/16W; PCB Footprint: R0402; Value: 0R; Part Type: НЁУГєсД¤µзЧи; Manufacturer PN: RC0402JR-070RL; Created by: YTL
R?#162 = RESISTOR_Dup2: НЁУГєсД¤µзЧи,0R,+/-5%,R0402,1/16W.; Part Reference: R5302; Manufacturer PN: RC0402JR-070RL; Manufacturer: YAGEO; Wattage: 1/16W; Priority: A; PCB Footprint: R0402; Value: 0R; Created by: YTL; Part Type: НЁУГєсД¤µзЧи; RK PN: RC0402JR-070RL
R?#163 = RESISTOR_Dup2: НЁУГєсД¤µзЧи,180K,+/-5%,R0402,1/16W.; Part Reference: R5303; Manufacturer PN: RC0402JR-07180KL; Manufacturer: YAGEO; Tolerance: 5%; Priority: A; Wattage: 1/16W; PCB Footprint: R0402; Value: 180K; Created by: YTL; Part Type: НЁУГєсД¤µзЧи; RK PN: RC0402JR-07180KL
R?#164 = RESISTOR_Dup2: НЁУГєсД¤µзЧи,100K,+/-5%,R0402,1/16W.; Part Reference: R2324; Manufacturer: YAGEO; RK PN: RC0402JR-07100KL; Priority: A; Wattage: 1/16W; PCB Footprint: R0402; Value: 100K; Part Type: НЁУГєсД¤µзЧи; Manufacturer PN: RC0402JR-07100KL; Created by: YTL
R?#165 = RESISTOR_Dup2: НЁУГєсД¤µзЧи,4K7,+/-5%,R0402,1/16W.; Part Reference: R2323; Manufacturer PN: RC0402JR-074K7L; Manufacturer: YAGEO; Wattage: 1/16W; Priority: A; PCB Footprint: R0402; Value: 4.7K; Created by: YTL; Part Type: НЁУГєсД¤µзЧи; RK PN: RC0402JR-074K7L
TP?#5 = TP: Test Point 0.7mm; Part Reference: TP5300; PCB Footprint: TP_0R70; RK PN: TESTPOINT_0R7; Priority: A; Value: TP_0.7; Part Type: TP; Created by: CZD
TP?#6 = TP: Test Point 0.7mm; Part Reference: TP5301; PCB Footprint: TP_0R70; Priority: A; RK PN: TESTPOINT_0R7; Value: TP_0.7; Created by: CZD; Part Type: TP
TP?#7 = TP: Test Point 0.7mm; Part Reference: TP5302; PCB Footprint: TP_0R70; RK PN: TESTPOINT_0R7; Priority: A; Value: TP_0.7; Part Type: TP; Created by: CZD
U?#40 = SWITCH_SY6280: 1A Current Limited Load Switch; Part Reference: U2306; Manufacturer PN: TT9107; Manufacturer: Torch-chipЈЁМАіПµзЧУЈ©; Priority: A; PCB Footprint: SOT_23_5; Value: SGM2576/TT9107; Created by: JJJ; Part Type: Switch; RK PN: TT9107